# EAGLE design random-keypad-door-controller-v01 (EAGLE 7.7.0)
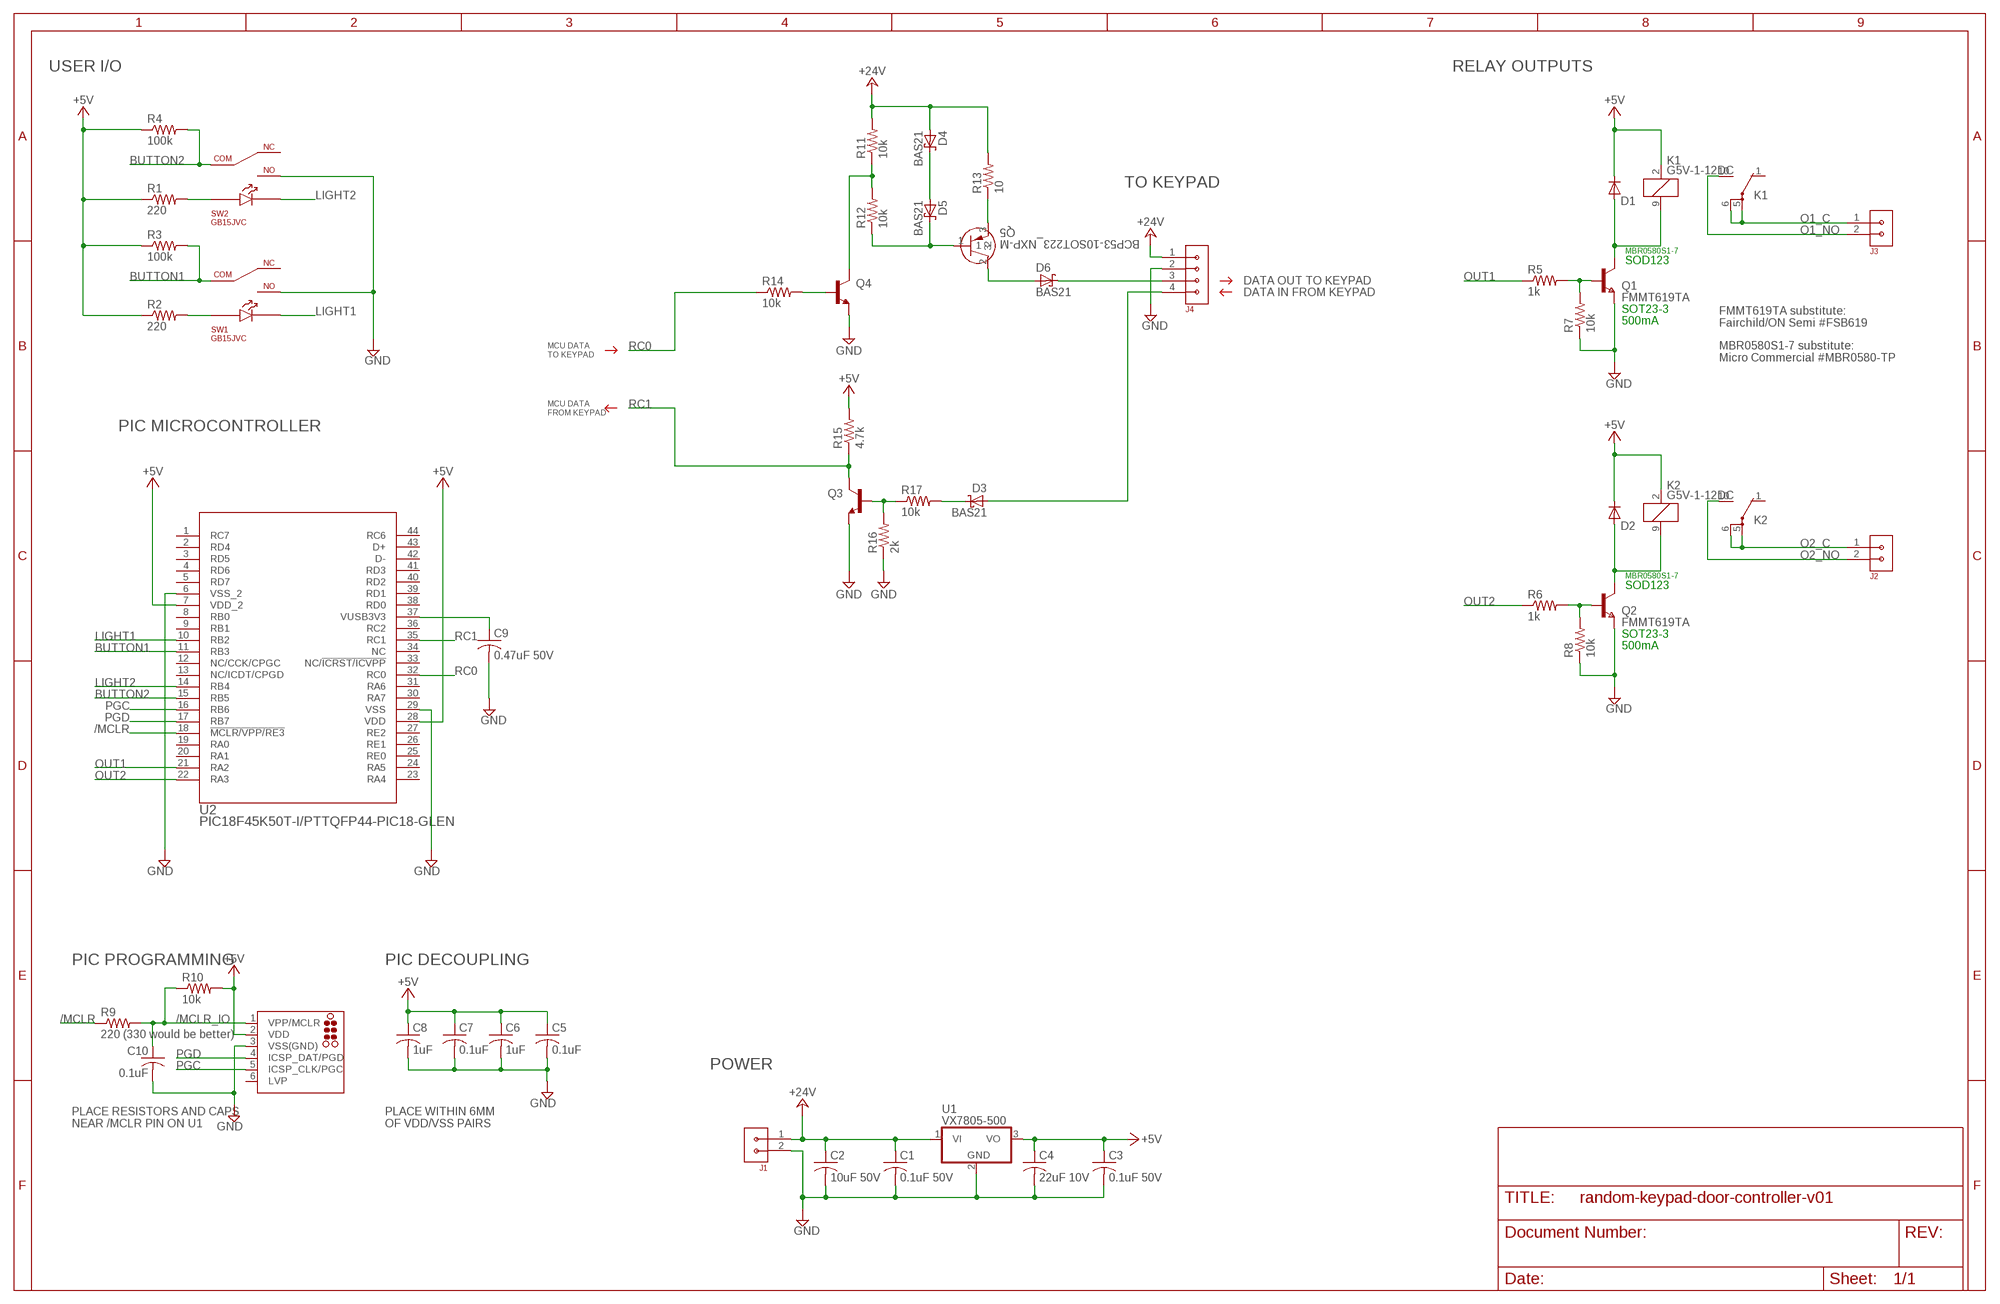
[diagram p0: schematic, sheet 1]

## Parts
C1  0.1uF 50V  C-USC1206K  [C1206K]
C2  10uF 50V  C-USC1210K  [C1210K]
C3  0.1uF 50V  C-USC1206K  [C1206K]
C4  22uF 10V  C-USC1206K  [C1206K]
C5  0.1uF  C-USC0603K  [C0603K]
C6  1uF  C-USC0603K  [C0603K]
C7  0.1uF  C-USC0603K  [C0603K]
C8  1uF  C-USC0603K  [C0603K]
C9  0.47uF 50V  C-USC1206K  [C1206K]
C10  0.1uF  C-USC0603K  [C0603K]
D1  1N4148W-TP  DIODE-SOD123  [SOD123]
D2  1N4148W-TP  DIODE-SOD123  [SOD123]
D3  BAS21  BAS40  [SOT23]
D4  BAS21  BAS40  [SOT23]
D5  BAS21  BAS40  [SOT23]
D6  BAS21  BAS40  [SOT23]
DEBUG  TC2030-MCP-NL  [TC2030-MCP-NL]
J1  CON-3.81MM-1X2-PHOENIX  [CON-PHOENIX-3.81-1X2-RA]
J2  CON-3.81MM-1X2-PHOENIX  [CON-PHOENIX-3.81-1X2-RA]
J3  CON-3.81MM-1X2-PHOENIX  [CON-PHOENIX-3.81-1X2-RA]
J4  CON-3.81MM-1X4-PHOENIX-1803293  [CON-PHOENIX-1803293-3.81-1X4]
K1  G5V-1-12DC  G5V1  [G5V1]
K2  G5V-1-12DC  G5V1  [G5V1]
Q1  FMMT619TA  NPNSOT23  [SOT-23]
Q2  FMMT619TA  NPNSOT23  [SOT-23]
Q3  BC817-40-NPN-SOT23-BEC  [SOT23-BEC]
Q4  BC817-40-NPN-SOT23-BEC  [SOT23-BEC]
Q5  BCP53-10SOT223_NXP-M  [SOT223_NXP-M]
R1  220  R-US_R0603  [R0603]
R2  220  R-US_R0603  [R0603]
R3  100k  R-US_R0603  [R0603]
R4  100k  R-US_R0603  [R0603]
R5  1k  R-US_R0603  [R0603]
R6  1k  R-US_R0603  [R0603]
R7  10k  R-US_R0603  [R0603]
R8  10k  R-US_R0603  [R0603]
R9  220 (330 would be better)  R-US_R0603  [R0603]
R10  10k  R-US_R0603  [R0603]
R11  10k  R-US_R0603  [R0603]
R12  10k  R-US_R0603  [R0603]
R13  10  R-US_R0603  [R0603]
R14  10k  R-US_R0603  [R0603]
R15  4.7k  R-US_R0603  [R0603]
R16  2k  R-US_R0603  [R0603]
R17  10k  R-US_R0603  [R0603]
SW1  GB15JVC  GB15JHC  [GB15JHC]
SW2  GB15JVC  GB15JHC  [GB15JHC]
U1  VX7805-500  CUI-V7803-500  [CUI-78XX-500]
U2  PIC18F45K50T-I/PTTQFP44-PIC18-GLEN  [TQFP44-PIC18-GLEN]

## Nets
+5V: C3.1 C4.1 C5.1 C6.1 C7.1 C8.1 D1.C D2.C DEBUG.2(VDD) K1.2 K2.2 R1.1 R2.1 R3.1 R4.1 R10.2 R15.2 U1.3(VO) U2.7(VDD_2) U2.28(VDD)
+24V: C1.1 C2.1 D4.1(A) J1.1 J4.1 R11.2 R13.2 U1.1(VI)
/MCLR: R9.1 U2.18(!MCLR/VPP/RE3)
/MCLR_IO: C10.1 DEBUG.1(VPP/MCLR) R9.2 R10.1
BUTTON1: R3.2 SW1.5 U2.11(RB3)
BUTTON2: R4.2 SW2.5 U2.15(RB5)
GND: C1.2 C2.2 C3.2 C4.2 C5.2 C6.2 C7.2 C8.2 C9.2 C10.2 DEBUG.3(VSS(GND)) J1.2 J4.2 Q1.2(E) Q2.2(E) Q3.E Q4.E R7.1 R8.1 R16.1 SW1.4 SW2.4 U1.2(GND) U2.6(VSS_2) U2.29(VSS)
LIGHT1: SW1.3 U2.10(RB2)
LIGHT2: SW2.3 U2.14(RB4)
N$1: Q2.3(B) R6.2 R8.2
N$2: D2.A K2.9 Q2.1(C)
N$3: R1.2 SW2.1
N$4: D6.1(A) Q5.2
N$6: R2.2 SW1.1
N$7: D6.3(C) J4.3
N$10: D4.3(C) D5.1(A)
N$11: Q5.3 R13.1
N$12: Q4.C R11.1 R12.2
N$13: D5.3(C) Q5.1 R12.1
N$14: Q4.B R14.2
N$16: Q1.3(B) R5.2 R7.2
N$17: Q3.B R16.2 R17.1
N$18: D3.3(C) R17.2
N$19: D3.1(A) J4.4
N$200: D1.A K1.9 Q1.1(C)
O1_C: J3.1 K1.5(2:P) K1.6(2:P)
O1_NO: J3.2 K1.10(2:S)
O2_C: J2.1 K2.5(2:P) K2.6(2:P)
O2_NO: J2.2 K2.10(2:S)
OUT1: R5.1 U2.21(RA2)
OUT2: R6.1 U2.22(RA3)
PGC: DEBUG.5(ICSP_CLK/PGC) U2.16(RB6)
PGD: DEBUG.4(ICSP_DAT/PGD) U2.17(RB7)
RC0: R14.1 U2.32(RC0)
RC1: Q3.C R15.1 U2.35(RC1)
VUSB: C9.1 U2.37(VUSB3V3)
Unconnected: DEBUG.6(LVP) K1.1(2:O) K2.1(2:O) SW1.6 SW2.6 U2.1(RC7) U2.2(RD4) U2.3(RD5) U2.4(RD6) U2.5(RD7) U2.8(RB0) U2.9(RB1) U2.12(NC/CCK/CPGC) U2.13(NC/ICDT/CPGD) U2.19(RA0) U2.20(RA1) U2.23(RA4) U2.24(RA5) U2.25(RE0) U2.26(RE1) U2.27(RE2) U2.30(RA7) U2.31(RA6) U2.33(NC/!ICRST/ICVPP) U2.34(NC) U2.36(RC2) U2.38(RD0) U2.39(RD1) U2.40(RD2) U2.41(RD3) U2.42(D-) U2.43(D+) U2.44(RC6)

## Notes on the sheet
- USER I/O | RELAY OUTPUTS
- TO KEYPAD
- MBR0580S1-7
- SOD123
- DATA OUT TO KEYPAD
- DATA IN FROM KEYPAD
- SOT23-3
- 500mA
- FMMT619TA substitute:
  Fairchild/ON Semi #FSB619
- MCU DATA
  TO KEYPAD
- MBR0580S1-7 substitute:
  Micro Commercial #MBR0580-TP
- MCU DATA
  FROM KEYPAD
- PIC MICROCONTROLLER
- MBR0580S1-7
- SOD123
- SOT23-3
- 500mA
- PIC PROGRAMMING | PIC DECOUPLING
- POWER
- PLACE RESISTORS AND CAPS
  NEAR /MCLR PIN ON U1
- PLACE WITHIN 6MM
  OF VDD/VSS PAIRS

## Library data of the parts
C1 C3 = rcl:C-US: CAPACITOR, American symbol; MFR: KEMET; MFR_PART_NO: C1206S104M5RACTU
C2 = rcl:C-US: CAPACITOR, American symbol; MFR: KEMET; MFR_PART_NO: C1210C106K5RACTU
C4 = rcl:C-US: CAPACITOR, American symbol; MFR: KEMET; MFR_PART_NO: C1206C226K8RAC7800
C5-C8 C10 = rcl:C-US: CAPACITOR, American symbol
C9 = rcl:C-US: CAPACITOR, American symbol; MFR: KEMET; MFR_PART_NO: C1206C474K5RACTU
D1 D2 = diode:DIODE-: DIODE; MFR: DIODES INC; MFR_PART_NO: MBR0580S1-7
D3-D6 = diode:BAS40: Silicon Schottky Diodes General-purpose diode for high-speed switching
DEBUG = tag-connect:TC2030: TAG-CONNECT ICSP Connector Manufacturer: Tag-Connect <http://www.tag-connect.com> Cable for easy In-Circuit Serial Programming. Designed for Microchip ICD2, suitable for many others. Two variants - one "with legs" (for hands-free fit on PCB) and another "without legs" for quick programming. PAD Description 1 MCLR/Vpp 2 Vdd 3 GND 4 PGD (ISPDAT) 5 PGC (ISPCLK) 6 nc (used for LVP) ©2009 ROFA.cz - modified and updated by Robert Darlington ‹rdarlington@gmail.com›
J1-J3 = 0GlenConnectors:CON-3.81MM-1X2-PHOENIX
J4 = 0GlenConnectors:CON-3.81MM-1X4-PHOENIX-1803293
K1 K2 = relay:G5V1: RELAY 1 x switch, 0.5 A/125 V AC, 1 A/24 V DC , Omron; MFR: OMRON; MFR_PART_NO: G5V-1-DC5; MPN: G5V-1-DC24; OC_FARNELL: 9949593; OC_NEWARK: 36M6377
Q1 Q2 = zetex:NPNSOT23: NPN TRANSISTOR; MFR: DIODES INC; MFR_PART_NO: FMMT619TA; MPN: DSS20201L-7; OC_FARNELL: 1710688; OC_NEWARK: 25R4555
Q3 Q4 = transistor:*-NPN-: NPN Transistror BF959 corrected 2008.03.06
Q5 = BCP53-10:BCP53-10; COPYRIGHT: Copyright (C) 2021 Ultra Librarian. All rights reserved.; DIGI-KEY_PART_NUMBER_1: 2721-BCP53-10-ND; DIGI-KEY_PART_NUMBER_2: 2796-BCP53-10-ND; DIGI-KEY_PART_NUMBER_3: 568-6104-1-ND; DIGI-KEY_PART_NUMBER_4: 568-6104-2-ND; DIGI-KEY_PART_NUMBER_5: 568-6104-6-ND; MANUFACTURER_PART_NUMBER: BCP53-10; MFR_NAME: NXP
R1-R4 R9 R10 = rcl:R-US_: RESISTOR, American symbol
R5-R8 = rcl:R-US_: RESISTOR, American symbol; MFR: BOURNS; MFR_PART_NO: CR1206-JW-102ELF
R11-R17 = resistor:R-US_: RESISTOR, American symbol
SW1 SW2 = GlenPartsLibrary:GB15JHC
U1 = GlenPartsLibrary:CUI-V7803-500
U2 = PIC18F45K50:PIC18F45K50T-I/PT

## Board
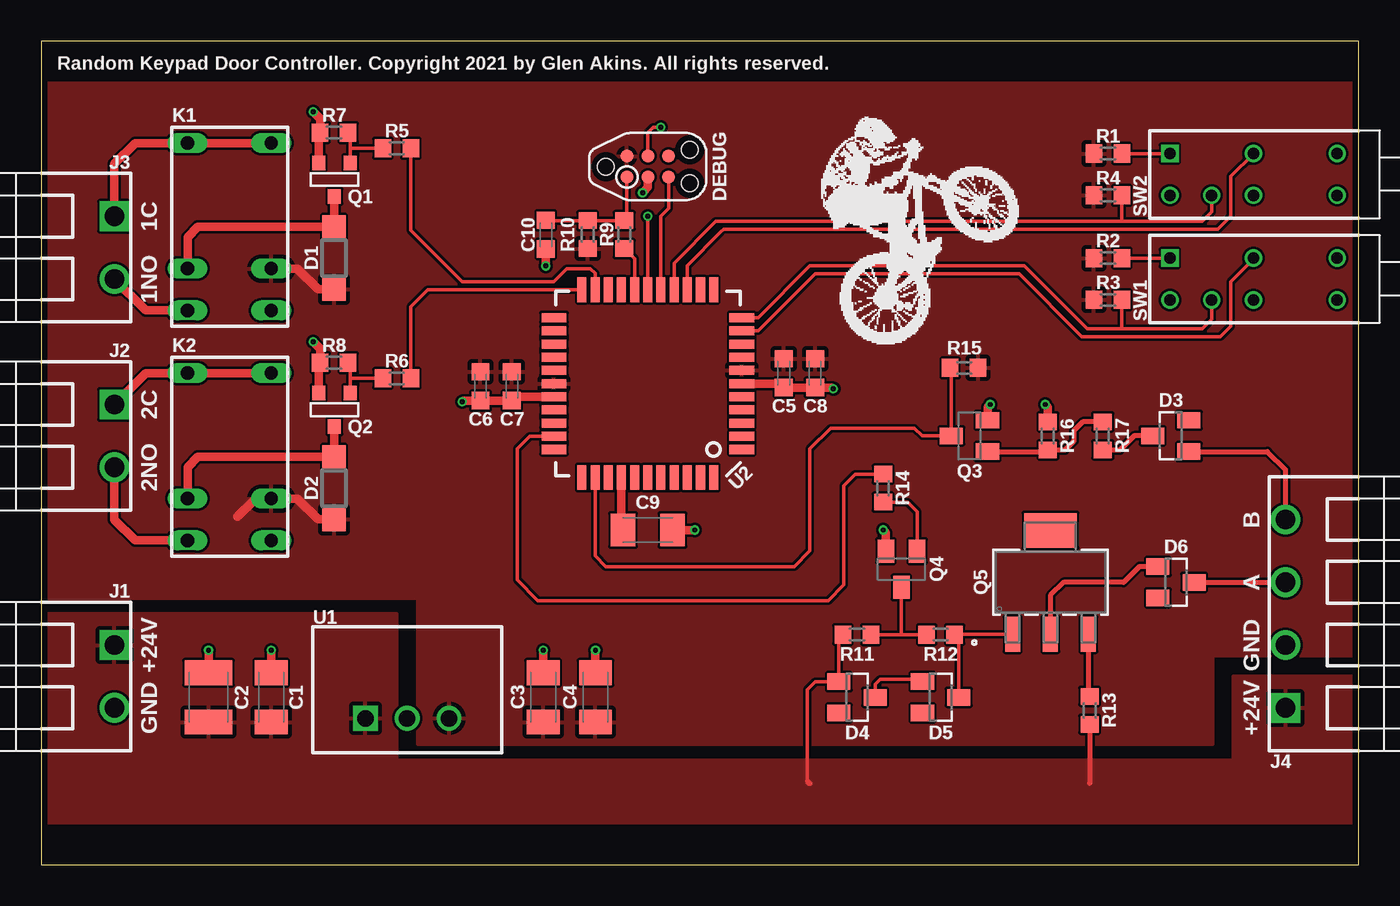
[diagram p1: board, top side]
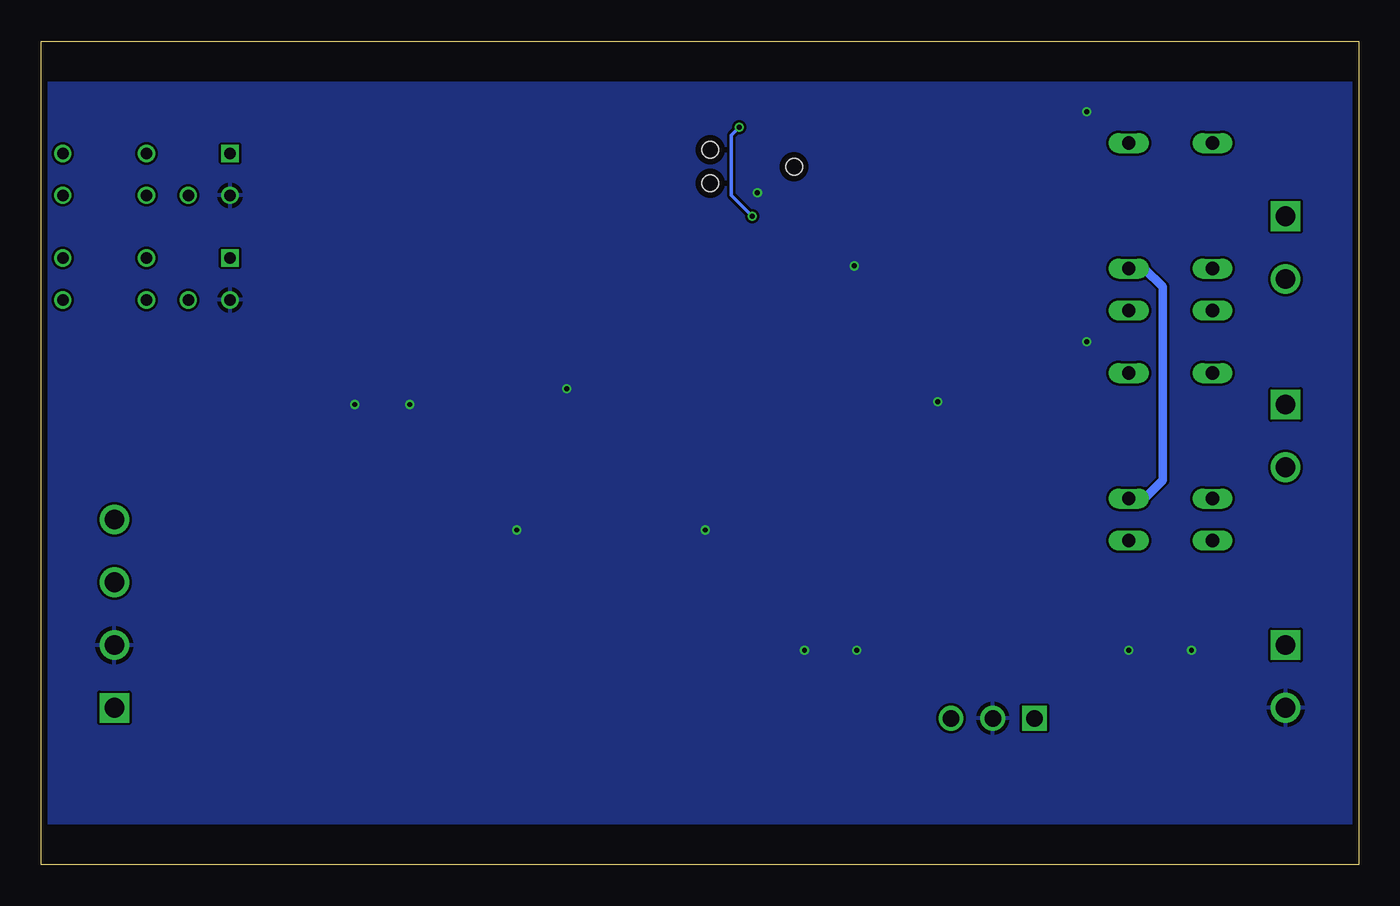
[diagram p2: board, bottom side, seen from below]

Size 80 x 50 mm. Coordinates in mm from the lower left corner, seen from the top.
Outline: 0,0 80,0 80,50 0,50 0,0
Copper layers (1*16): Top 0.035559375mm / dielectric 1.6mm / Bottom 0.035559375mm
Design rules "oshpark-2layer-2018": minimum track width 6mil, minimum drill 10mil, track to track 6mil, track to pad 6mil, pad to pad 6mil, via to via 6mil, smd to smd 6mil, copper to edge 15mil, drill to drill 6mil, minimum pad ring 5mil, minimum via ring 5mil, stop-mask expansion 2.5mil, vias tented up to drill 0mil, thermal gap 10mil

### Footprints (pad centres in the part's own frame; a part is rotated, then mirrored left to right if it is on the bottom)
C1206K = smd 1.5 x 2: 1 -1.5,0; 2 1.5,0
C1210K = smd 1.5 x 2.9: 1 -1.5,0; 2 1.5,0
C0603K = smd 1.05 x 1.08: 1 -0.875,0; 2 0.875,0
SOD123 = smd 1.4 x 1.4: A 1.9,0; C -1.9,0
SOT23 = smd 1 x 1.4: 1 -0.95,-1.1; 2 0.95,-1.1; 3 0,1.1
TC2030-MCP-NL = smd 0.787 x 0.787: 1 1.27,-0.635; 2 1.27,0.635; 3 2.54,-0.635; 4 2.54,0.635; 5 3.81,-0.635; 6 3.81,0.635 | hole 0.991: 0,0; 5.08,-1.016; 5.08,1.016
CON-PHOENIX-3.81-1X2-RA = drill 1.2 square: 1 0,0 | drill 1.2: 2 3.81,0
CON-PHOENIX-1803293-3.81-1X4 = drill 1.2 square: 1 0,0 | drill 1.2: 2 3.81,0; 3 7.62,0; 4 11.43,0
G5V1 = drill 0.813 long: 1 -5.08,-2.54; 2 -2.54,-2.54; 5 5.08,-2.54; 6 5.08,2.54; 9 -2.54,2.54; 10 -5.08,2.54
SOT-23 = smd 0.787 x 0.889: 1 0.025,-1.016; 2 -0.94,1.016; 3 0.991,1.016
SOT23-BEC = smd 1 x 1.4: B -0.95,-1.1; C 0,1.1; E 0.95,-1.1
SOT223_NXP-M = smd 0.914 x 2.108: 1 -2.3,-3.15; 2 0,-3.15; 3 2.3,-3.15 | smd 3.2 x 2.108: 4 0,3.15
R0603 = smd 1 x 1.1: 1 -0.85,0; 2 0.85,0
GB15JHC = drill 0.7 square: 1 1.27,12.751 | drill 0.7: 3 1.27,7.671; 4 -1.27,12.751; 5 -1.27,10.211; 6 -1.27,7.671; NC.1 1.27,2.591; NC.2 -1.27,2.591
CUI-78XX-500 = drill 1 square: 1 0,0 | drill 1: 2 2.54,0; 3 5.08,0
TQFP44-PIC18-GLEN = smd 1.5 x 0.55: 1 -5.7,4; 2 -5.7,3.2; 3 -5.7,2.4; 4 -5.7,1.6; 5 -5.7,0.8; 6 -5.7,0; 7 -5.7,-0.8; 8 -5.7,-1.6; 9 -5.7,-2.4; 10 -5.7,-3.2; 11 -5.7,-4; 23 5.7,-4; 24 5.7,-3.2; 25 5.7,-2.4; 26 5.7,-1.6; 27 5.7,-0.8; 28 5.7,0; 29 5.7,0.8; 30 5.7,1.6; 31 5.7,2.4; 32 5.7,3.2; 33 5.7,4 | smd 0.55 x 1.5: 12 -4,-5.7; 13 -3.2,-5.7; 14 -2.4,-5.7; 15 -1.6,-5.7; 16 -0.8,-5.7; 17 0,-5.7; 18 0.8,-5.7; 19 1.6,-5.7; 20 2.4,-5.7; 21 3.2,-5.7; 22 4,-5.7; 34 4,5.7; 35 3.2,5.7; 36 2.4,5.7; 37 1.6,5.7; 38 0.8,5.7; 39 0,5.7; 40 -0.8,5.7; 41 -1.6,5.7; 42 -2.4,5.7; 43 -3.2,5.7; 44 -4,5.7

### Placement (x,y rotation side)
C1  13.97,10.16 90 top
C2  10.16,10.16 90 top
C3  30.48,10.16 90 top
C4  33.66,10.16 90 top
C5  45.09,29.84 270 top
C6  26.67,29.05 270 top
C7  28.57,29.05 270 top
C8  46.99,29.84 270 top
C9  36.83,20.32 0 top
C10  30.64,38.26 270 top
D1  17.78,36.83 90 top
D2  17.78,22.86 90 top
D3  68.58,26.04 90 top
D4  49.53,10.16 270 top
D5  54.61,10.16 270 top
D6  68.9,17.14 270 top
DEBUG  34.29,42.39 0 top
J1  4.45,13.34 270 top
J2  4.45,27.94 270 top
J3  4.45,39.37 270 top
J4  75.55,9.53 90 top
K1  11.43,38.73 90 top
K2  11.43,24.77 90 top
Q1  17.78,41.59 0 top
Q2  17.78,27.62 0 top
Q3  56.36,26.04 90 top
Q4  52.23,17.94 180 top
Q5  61.28,17.14 0 top
R1  64.77,43.18 0 top
R2  64.77,36.83 0 top
R3  64.77,34.29 0 top
R4  64.77,40.64 0 top
R5  21.59,43.5 180 top
R6  21.59,29.53 180 top
R7  17.78,44.45 0 top
R8  17.78,30.48 0 top
R9  35.4,38.26 90 top
R10  33.18,38.26 270 top
R11  49.53,13.97 180 top
R12  54.61,13.97 180 top
R13  63.66,9.37 270 top
R14  51.12,22.86 270 top
R15  56.04,30.16 0 top
R16  61.12,26.04 270 top
R17  64.45,26.04 270 top
SW1  81.28,35.56 90 top
SW2  81.28,41.91 90 top
U1  19.68,8.89 0 top
U2  36.83,29.21 180 top

### Tracks (layer width: path | path; a pad name or v marks a point on that pad's centre or on a via)
+5V
  Top 0.508: K1.2 15.56,36.2 16.82,34.93 D1.C | D2.C 16.82,20.96 15.56,22.23 K2.2 13.02,22.23 11.91,21.11
  Bottom 0.508: 13.02,36.2 11.91,35.08 11.91,23.34 13.02,22.23 K2.2
  pour Top (isolate 0.152): 0,47.46 0,16.19 22.86,16.19 22.86,7.3 71.12,7.3 71.12,12.7 80.01,12.7 80.01,47.46
+24V
  Top 0.203: 48.43,13.72 D4.1 46.99,11.11 46.51,10.64 46.51,5.08
  Top 0.305: R13.2 63.66,4.92 | 48.43,13.72 R11.2 | 46.51,5.08 46.67,4.92
  pour Top (isolate 0.152): 0,15.24 21.59,15.24 21.59,6.35 72.39,6.35 72.39,11.43 80.01,11.43 80.01,2.54 0,2.54
/MCLR
  Top 0.203: U2.18 36.03,36.78 R9.1
/MCLR_IO
  Top 0.203: DEBUG.1 35.56,39.27 R9.2 R10.1 30.66,39.11 C10.1
BUTTON1
  Top 0.203: 65.72,32.54 63.5,32.54 59.69,36.35 46.67,36.35 43.53,33.21 U2.11 | 65.72,32.54 70.48,32.54 71.07,33.13 SW1.5 | R3.2 65.62,32.65 65.72,32.54
BUTTON2
  Top 0.203: U2.15 38.43,36.52 40.96,39.05 65.56,39.05 | 65.56,39.05 70.48,39.05 71.07,39.64 SW2.5 | R4.2 65.62,39.11 65.56,39.05
GND  (via drill 0.3)
  Top 0.508: v16.51,45.72 16.93,45.3 R7.1 16.84,44.36 Q1.2 | v16.51,31.75 16.93,31.33 R8.1 16.84,30.39 Q2.2 | C2.2 v10.16,13.02 | C1.2 v13.97,13.02 | C3.2 v30.48,13.02 | C4.2 v33.66,13.02 | U2.6 44.84,29.21 C5.2 C8.2 48.02,28.97 v48.1,28.89 | U2.29 28.81,28.41 C7.2 C6.2 25.64,28.18 v25.56,28.1 | C9.2 v39.69,20.32 | DEBUG.3 36.83,41.12 v36.51,40.8 | C10.2 v30.64,36.35 | R16.1 61.12,27.78 v60.96,27.94 | Q4.E 51.28,20.16 v51.12,20.32 | Q3.E 57.46,27.77 v57.63,27.94
  pour Bottom (isolate 0.152): 0,2.54 80.01,2.54 80,47.46 0,47.46
LIGHT1
  Top 0.203: SW1.3 73.61,36.78 72.23,35.4 72.23,32.7 71.6,32.07 63.18,32.07 59.37,35.88 46.99,35.88 43.52,32.41 U2.10
LIGHT2
  Top 0.203: U2.14 39.23,36.37 41.27,38.42 41.43,38.58 71.44,38.58 72.23,39.37 72.23,41.8 SW2.3
N$1
  Top 0.203: Q2.3 18.77,29.53 | 18.77,29.53 18.77,30.34 | R6.2 18.77,29.53
  Top 0.508: 18.77,30.34 R8.2
N$2
  Top 0.508: Q2.1 17.8,24.79 D2.A 9.52,24.76 8.89,24.13 K2.9
N$3
  Top 0.203: R1.2 SW2.1
N$4
  Top 0.305: D6.1 66.67,18.09 65.72,17.14 62.07,17.14 61.28,16.35 Q5.2
N$6
  Top 0.203: R2.2 SW1.1
N$7
  Top 0.305: D6.3 J4.3
N$10
  Top 0.203: D4.3 50.63,10.94 50.96,11.27 53.35,11.27
  Top 0.305: 53.35,11.27 D5.1
N$11
  Top 0.305: Q5.3 63.58,10.3 R13.1
N$12
  Top 0.203: R11.1 52.23,13.97 | 52.23,13.97 R12.2 | Q4.C 52.23,13.97
N$13
  Top 0.203: Q5.1 55.48,13.99 | D5.3 55.71,13.72
  Top 0.305: 55.48,13.99 R12.1 55.71,13.72
N$14
  Top 0.203: Q4.B 53.18,21.43 52.6,22.01 R14.2
N$16
  Top 0.203: Q1.3 18.77,43.5 | 18.77,43.5 18.77,44.31 | R5.2 18.77,43.5
  Top 0.508: 18.77,44.31 R7.2
N$17
  Top 0.203: 61.02,25.09 R16.2
  Top 0.305: Q3.B 61.02,25.09 | R16.2 62.17,25.18 62.71,25.72 62.71,26.35 63.24,26.89 R17.1
N$18
  Top 0.305: R17.2 65.51,25.18 66.36,26.04 D3.3
N$19
  Top 0.305: D3.1 74.45,25.09 75.56,23.98 J4.4
N$200
  Top 0.508: Q1.1 17.8,38.76 D1.A 9.52,38.73 8.89,38.1 K1.9
O1_C
  Top 0.508: K1.5 K1.6 5.71,43.81 4.45,42.55 J3.1
O1_NO
  Top 0.508: K1.10 6.35,33.66 J3.2
O2_C
  Top 0.508: J2.1 6.35,29.84 K2.6 K2.5
O2_NO
  Top 0.508: K2.10 5.71,19.68 4.45,20.95 J2.2
OUT1
  Top 0.203: R5.1 22.44,38.52 25.56,35.4 31.11,35.4 31.91,36.2 33.34,36.2 33.63,35.9 U2.21
OUT2
  Top 0.203: U2.22 23.48,34.91 22.44,33.87 R6.1
PGC
  Top 0.203: U2.16 37.63,39.38 38.1,39.85 DEBUG.5
PGD  (via drill 0.3)
  Top 0.203: U2.17 v36.83,39.37 | v37.62,44.77 37.15,44.77 36.83,44.45 DEBUG.4
  Bottom 0.203: v36.83,39.37 38.1,40.64 38.1,44.29 v37.62,44.77
RC0
  Top 0.203: U2.32 29.66,26.01 28.89,25.24 28.89,17.3 30.16,16.03 47.78,16.03 48.74,16.99 48.74,23.02 49.43,23.71 R14.1
RC1
  Top 0.203: R15.1 55.26,29.94 Q3.C 53.5,26.04 53.02,26.51 47.94,26.51 46.67,25.24 46.67,19.05 45.72,18.1 34.29,18.1 33.63,18.76 U2.35
VUSB
  Top 0.508: U2.37 35.23,20.4 C9.1

### Text on the board
_tsilk: Random Keypad Door Controller. Copyright 2021 by Glen Akins. All rights reserved. | K1 | R7 | R5 | R1 | J3 | DEBUG | Q1 | R4 | 1C | SW2 | C10 | R10 | R9 | D1 | R2 | 1NO | R3 | SW1 | J2 | K2 | R8 | R15 | R6 | 2C | C5 | C8 | D3 | Q2 | C6 | C7 | R16 | R17 | 2NO | U2 | Q3 | D2 | R14 | C9 | B | D6 | Q4 | Q5 | A | J1 | U1 | +24V | R11 | R12 | GND | GND | C2 | C1 | C3 | C4 | +24V | R13 | D4 | D5 | J4